# EAGLE design at88g.v1 (EAGLE 4.11)
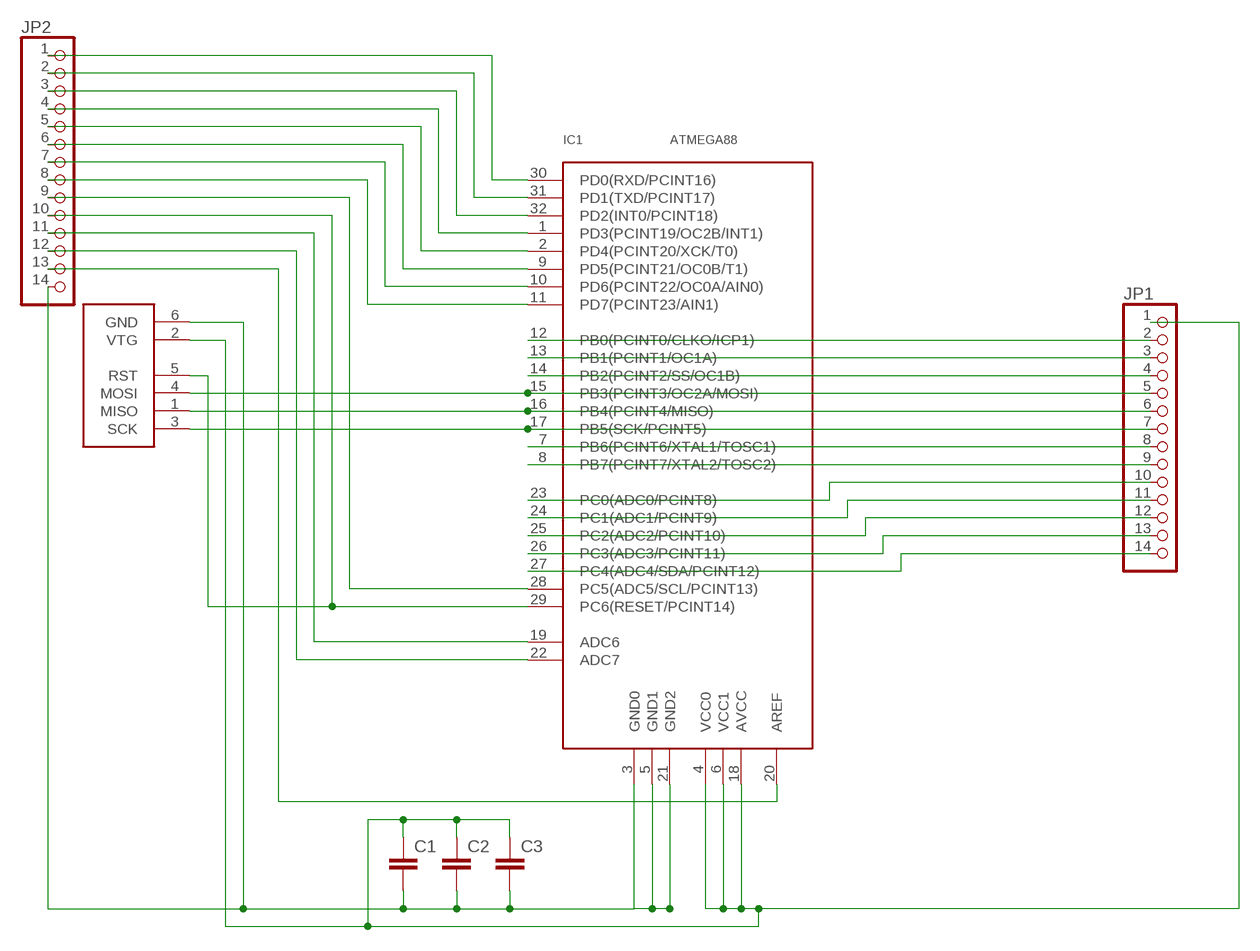
[diagram p0: schematic, sheet 1]

## Parts
C1  C-EUC0603  [C0603]
C2  C-EUC0603  [C0603]
C3  C-EUC0603  [C0603]
IC1  ATMEGA88  [TQFP32]
JP1  PINHD-1X14  [1X14]
JP2  PINHD-1X14  [1X14]
X1  AVRISP6PIN  [6PIN]

## Nets
GND0: C1.2 C2.2 C3.2 IC1.3(GND0) IC1.5(GND1) IC1.21(GND2) JP2.14 X1.6(GND)
N$1: IC1.29(PC6(RESET/PCINT14)) JP2.10 X1.5(RST)
N$2: IC1.15(PB3(PCINT3/OC2A/MOSI)) JP1.5 X1.4(MOSI)
N$3: IC1.16(PB4(PCINT4/MISO)) JP1.6 X1.1(MISO)
N$4: IC1.17(PB5(SCK/PCINT5)) JP1.7 X1.3(SCK)
N$5: IC1.30(PD0(RXD/PCINT16)) JP2.1
N$6: IC1.31(PD1(TXD/PCINT17)) JP2.2
N$7: IC1.32(PD2(INT0/PCINT18)) JP2.3
N$8: IC1.1(PD3(PCINT19/OC2B/INT1)) JP2.4
N$9: IC1.2(PD4(PCINT20/XCK/T0)) JP2.5
N$10: IC1.9(PD5(PCINT21/OC0B/T1)) JP2.6
N$11: IC1.10(PD6(PCINT22/OC0A/AIN0)) JP2.7
N$12: IC1.11(PD7(PCINT23/AIN1)) JP2.8
N$13: IC1.12(PB0(PCINT0/CLKO/ICP1)) JP1.2
N$14: IC1.13(PB1(PCINT1/OC1A)) JP1.3
N$15: IC1.14(PB2(PCINT2/SS/OC1B)) JP1.4
N$16: IC1.7(PB6(PCINT6/XTAL1/TOSC1)) JP1.8
N$17: IC1.8(PB7(PCINT7/XTAL2/TOSC2)) JP1.9
N$18: IC1.23(PC0(ADC0/PCINT8)) JP1.10
N$19: IC1.24(PC1(ADC1/PCINT9)) JP1.11
N$20: IC1.25(PC2(ADC2/PCINT10)) JP1.12
N$21: IC1.26(PC3(ADC3/PCINT11)) JP1.13
N$22: IC1.27(PC4(ADC4/SDA/PCINT12)) JP1.14
N$23: IC1.28(PC5(ADC5/SCL/PCINT13)) JP2.9
N$24: IC1.19(ADC6) JP2.11
N$25: IC1.22(ADC7) JP2.12
N$26: IC1.20(AREF) JP2.13
VCC0: C1.1 C2.1 C3.1 IC1.4(VCC0) IC1.6(VCC1) IC1.18(AVCC) JP1.1 X1.2(VTG)

## Library data of the parts
C1-C3 = rcl:C-EU: CAPACITOR, European symbol
IC1 = atmega88:ATMEGA88
JP1 JP2 = pinhead-mm:PINHD-1X14
X1 = avrisp:AVRISP6PIN

## Board
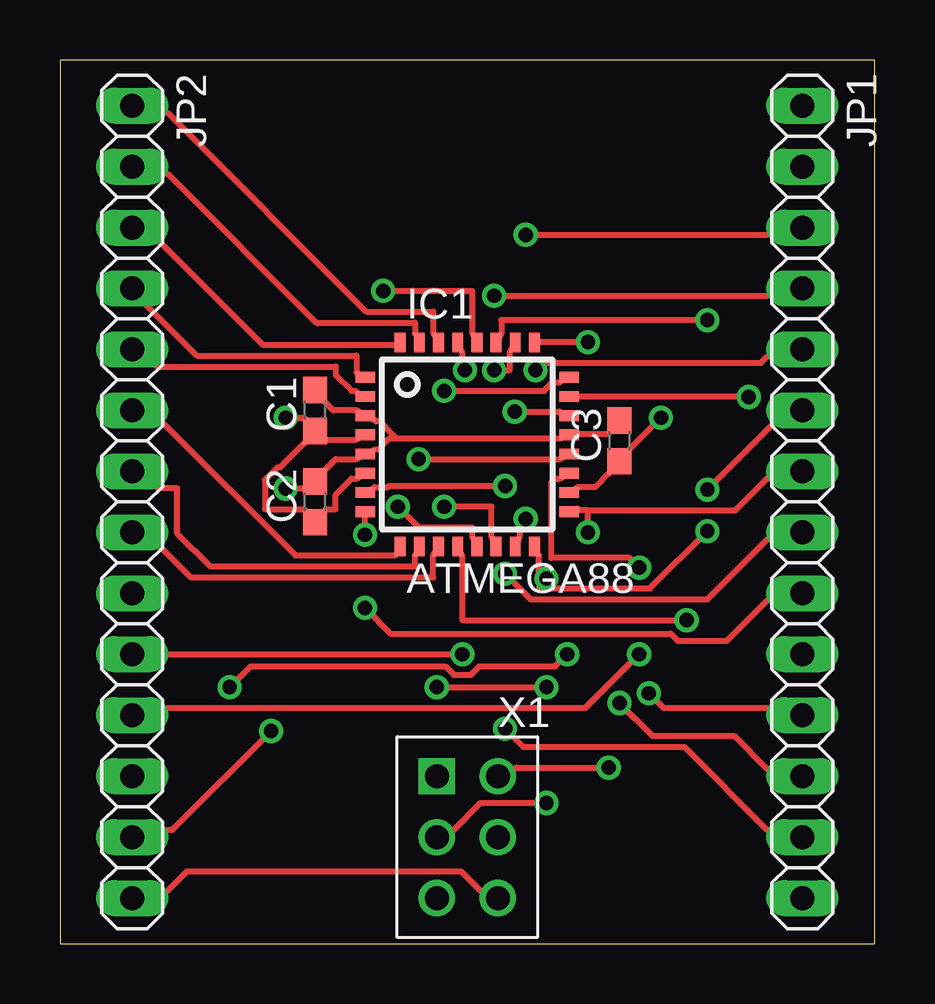
[diagram p1: board, top side]
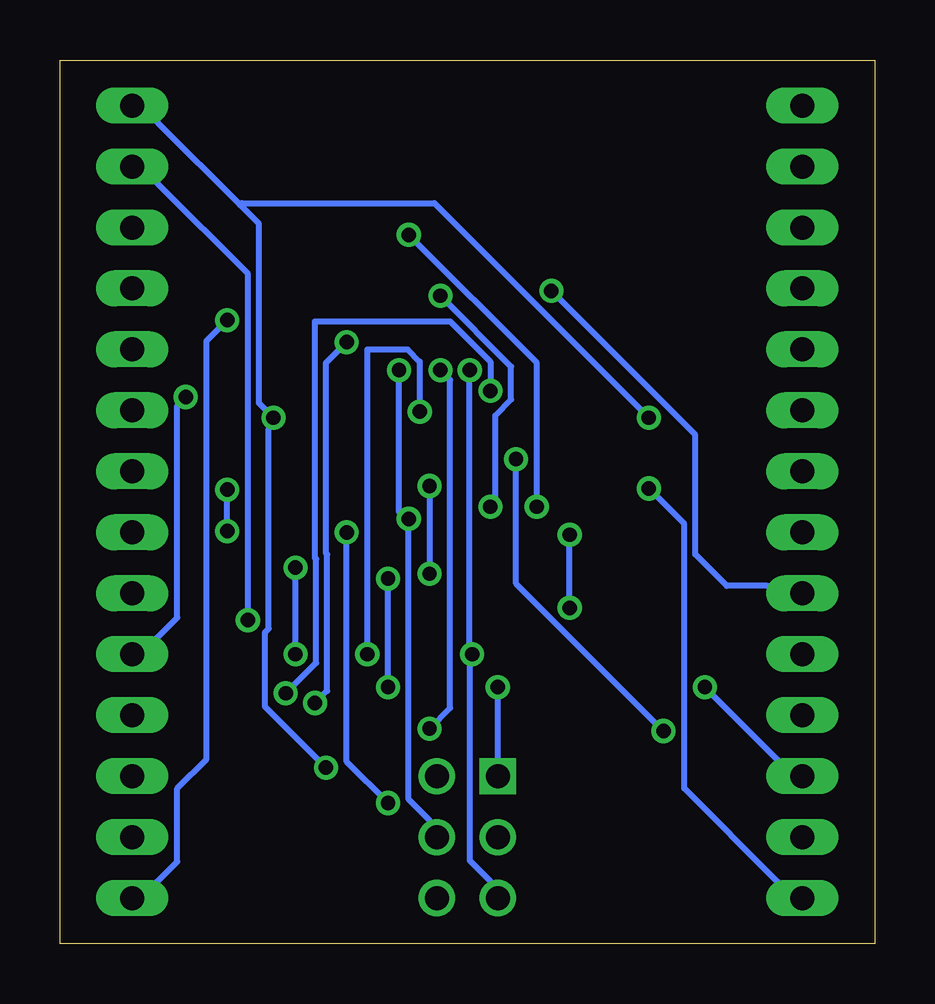
[diagram p2: board, bottom side, seen from below]

Size 33.96 x 36.82 mm. Coordinates in mm from the lower left corner, seen from the top.
Outline: 0,0 33.96,0 33.96,36.82 0,36.82 0,0
Copper layers (1*16): Top 0.035mm / dielectric 1.5mm / Bottom 0.035mm
Design rules "default": minimum track width 10mil, minimum drill 0.6mm, track to track 8mil, track to pad 8mil, pad to pad 8mil, via to via 8mil, smd to smd 8mil, copper to edge 40mil, drill to drill 8mil, minimum pad ring 10mil, minimum via ring 8mil, stop-mask expansion 4mil, vias tented up to drill 0mil, thermal gap 10mil

### Footprints (pad centres in the part's own frame; a part is rotated, then mirrored left to right if it is on the bottom)
C0603 = smd 1.1 x 1: 1 -0.85,0; 2 0.85,0
TQFP32 = smd 0.8 x 0.45: 1 -4.25,2.65; 2 -4.25,1.85; 3 -4.25,1.05; 4 -4.25,0.25; 5 -4.25,-0.55; 6 -4.25,-1.35; 7 -4.25,-2.15; 8 -4.25,-2.95; 17 4.25,-2.95; 18 4.25,-2.15; 19 4.25,-1.35; 20 4.25,-0.55; 21 4.25,0.25; 22 4.25,1.05; 23 4.25,1.85; 24 4.25,2.65 | smd 0.45 x 0.8: 9 -2.8,-4.4; 10 -2,-4.4; 11 -1.2,-4.4; 12 -0.4,-4.4; 13 0.4,-4.4; 14 1.2,-4.4; 15 2,-4.4; 16 2.8,-4.4; 25 2.8,4.1; 26 2,4.1; 27 1.2,4.1; 28 0.4,4.1; 29 -0.4,4.1; 30 -1.2,4.1; 31 -2,4.1; 32 -2.8,4.1
1X14 = drill 1 long: 1 -16.51,0; 2 -13.97,0; 3 -11.43,0; 4 -8.89,0; 5 -6.35,0; 6 -3.81,0; 7 -1.27,0; 8 1.27,0; 9 3.81,0; 10 6.35,0; 11 8.89,0; 12 11.43,0; 13 13.97,0; 14 16.51,0
6PIN = drill 1 square: 1 -1.27,2.54 | drill 1 round: 2 1.27,2.54; 3 -1.27,0; 4 1.27,0; 5 -1.27,-2.54; 6 1.27,-2.54

### Placement (x,y rotation side)
C1  10.63,22.22 90 top
C2  10.63,18.41 90 top
C3  23.33,20.95 90 top
IC1  16.98,20.95 0 top
JP1  30.95,18.41 270 top
JP2  3.01,18.41 270 top
X1  16.98,4.44 0 top

### Tracks (layer width: path | path; a pad name or v marks a point on that pad's centre or on a via)
GND0  (via drill 0.6)
  Top 0.254: C1.2 11.09,22.53 11.39,22.22 12.36,22.22 IC1.3 13.12,21.81 13.17,21.76 13.32,21.76 13.93,21.15 13.93,21.05 | C3.2 22.87,21.26 21.6,21.26 IC1.21 20.84,21.05 13.93,21.05 | 13.93,21.05 13.73,21.05 13.27,20.59 13.12,20.59 IC1.5 12.36,20.19 11.49,20.19 11.09,19.78 C2.2 10.17,18.97 v9.41,18.97 | JP2.14 4.48,2.21 5.3,3.02 16.73,3.02 17.54,2.21 X1.6
  Bottom 0.254: v9.41,18.97 7.94,17.5 7.94,6.47 4.08,2.61 JP2.14
N$1  (via drill 0.6)
  Top 0.254: v16.88,23.9 16.78,23.9 16.78,24.66 IC1.29 | JP2.10 v16.78,12.06
  Bottom 0.254: 16.88,12.06 16.88,3.48 16.02,2.61 X1.5 | 16.88,12.06 v16.88,23.9 | v16.78,12.06 16.88,12.06
N$2  (via drill 0.6)
  Top 0.254: v19.42,17.7 19.16,17.7 19.16,16.94 IC1.15 | v19.82,23.9 20.13,24.2 29.22,24.2 29.48,24.45 JP1.5
  Bottom 0.254: X1.4 18.55,5.15 19.42,6.02 v19.42,17.7 19.82,18 v19.82,23.9
N$3  (via drill 0.6)
  Top 0.254: 19.98,15.21 19.98,14.8 24.6,14.8 v26.99,17.19 | 19.98,15.21 19.98,16.18 IC1.16 | v26.99,18.92 29.73,21.66 JP1.6 | v15.71,10.69 v20.28,10.69 | v20.28,15.21 19.98,15.21
  Bottom 0.254: v26.99,17.19 v26.99,18.92 | v20.28,10.69 v20.28,15.21 | X1.1 v15.71,10.69
N$4  (via drill 0.6)
  Top 0.254: 22.01,18.05 28.16,18.05 29.48,19.38 JP1.7 | 22.01,18.05 21.6,18.05 IC1.17 | v20.28,5.86 17.54,5.86 16.42,4.75 X1.3 | v22.01,17.14 22.01,18.05
  Bottom 0.254: v20.28,5.86 22.01,7.59 v22.01,17.14
N$5
  Top 0.254: IC1.30 15.56,25.42 15.56,26.34 12.76,26.34 4.48,34.62 JP2.1
N$6
  Top 0.254: IC1.31 14.8,25.42 14.8,25.88 10.68,25.88 4.48,32.08 JP2.2
N$7
  Top 0.254: IC1.32 13.98,24.96 8.45,24.96 4.18,29.23 JP2.3
N$8
  Top 0.254: IC1.1 12.36,23.8 12.36,24.51 5.7,24.51 3.62,26.59 JP2.4
N$9
  Top 0.254: IC1.2 12.36,22.98 12.31,23.03 12.15,23.03 11.49,23.69 11.49,24.05 4.08,24.05 JP2.5
N$10
  Top 0.254: IC1.9 13.98,16.18 9.82,16.18 4.28,21.71 JP2.6
N$11
  Top 0.254: IC1.10 14.8,16.18 14.8,15.72 6.26,15.72 4.89,17.09 4.89,18.97 4.08,18.97 JP2.7
N$12
  Top 0.254: IC1.11 15.56,16.18 15.56,15.26 5.45,15.26 4.18,16.53 JP2.8
N$13  (via drill 0.6)
  Top 0.254: v26.12,13.48 16.78,13.48 16.78,16.18 IC1.12
  Bottom 0.254: v26.12,13.48 26.12,27.91 29.88,31.67 JP1.2
N$14  (via drill 0.6)
  Top 0.254: v14.08,18.21 14.95,17.34 17.18,17.34 17.18,16.94 IC1.13 | v19.42,29.53 29.48,29.53 JP1.3
  Bottom 0.254: v14.08,18.21 14.08,24.2 v19.42,29.53
N$15  (via drill 0.6)
  Top 0.254: v16.02,18.21 18,18.21 18,16.94 IC1.14 | v18.1,27 29.48,27 JP1.4
  Bottom 0.254: v16.02,18.21 15.81,18.41 15.81,22.02 15.15,22.68 15.15,24.05 v18.1,27
N$16  (via drill 0.6)
  Top 0.254: v18.55,19.07 13.73,19.07 13.68,19.02 13.12,19.02 IC1.7 | v18.55,15.41 19.62,14.35 26.99,14.35 29.48,16.84 JP1.8
  Bottom 0.254: v18.55,19.07 v18.55,15.41
N$17  (via drill 0.6)
  Top 0.254: v12.71,17.04 12.71,17.8 IC1.8 | v12.71,13.99 13.78,12.92 25.46,12.92 25.77,12.62 27.8,12.62 29.48,14.3 JP1.9
  Bottom 0.254: v12.71,13.99 v12.71,17.04
N$18  (via drill 0.6)
  Top 0.254: v28.71,22.78 21.6,22.78 IC1.23
  Bottom 0.254: v28.71,22.78 29.07,22.42 29.07,13.58 29.88,12.77 JP1.10
N$19  (via drill 0.6)
  Top 0.254: v16.02,23.03 20.18,23.03 20.54,23.39 20.84,23.39 IC1.24 | v24.55,10.43 25.16,9.83 29.48,9.83 JP1.11
  Bottom 0.254: v16.02,23.03 16.02,24.25 17.69,25.93 23.33,25.93 23.33,16.07 23.28,16.02 23.28,11.7 v24.55,10.43
N$20  (via drill 0.6)
  Top 0.254: v22.01,25.06 19.98,25.06 IC1.25 | v23.33,10.03 24.7,8.66 28.11,8.66 29.48,7.29 JP1.12
  Bottom 0.254: v22.01,25.06 22.87,24.2 22.87,16.28 22.82,16.23 22.82,10.54 v23.33,10.03
N$21  (via drill 0.6)
  Top 0.254: v18.1,23.9 18.76,23.9 18.76,24.66 IC1.26 | v18.55,8.96 19.32,8.2 26.02,8.2 29.48,4.75 JP1.13
  Bottom 0.254: v18.1,23.9 17.69,23.49 17.69,9.83 v18.55,8.96
N$22  (via drill 0.6)
  Top 0.254: v26.99,25.98 18.4,25.98 18.4,25.42 IC1.27
  Bottom 0.254: v26.99,25.98 27.85,25.12 27.85,7.69 29.07,6.47 29.07,3.42 29.88,2.61 JP1.14
N$23  (via drill 0.6)
  Top 0.254: v13.48,27.2 17.18,27.2 17.18,25.42 IC1.28
  Bottom 0.254: v13.48,27.2 7.48,21.2 7.48,16.23 6.16,14.91 4.48,14.91 JP2.9
N$24  (via drill 0.6)
  Top 0.254: v24.14,15.67 23.74,16.07 20.48,16.07 20.48,19.22 20.64,19.38 20.84,19.38 IC1.19 | v24.14,12.06 21.91,9.83 4.48,9.83 JP2.11
  Bottom 0.254: v24.14,12.06 v24.14,15.67
N$25  (via drill 0.6)
  Top 0.254: v18.96,22.17 20.84,22.17 IC1.22 | v21.15,12.06 20.64,11.55 17.49,11.55 17.13,11.2 16.42,11.2 16.07,11.55 7.94,11.55 v7.07,10.69
  Bottom 0.254: v18.96,22.17 18.96,24.25 19.47,24.76 21.15,24.76 v21.15,12.06 | v7.07,10.69 4.08,7.69 JP2.12
N$26  (via drill 0.6)
  Top 0.254: v14.95,20.19 20.84,20.19 IC1.20 | v8.8,8.86 4.69,4.75 4.48,4.75 JP2.13
  Bottom 0.254: v14.95,20.19 14.95,15.01 v8.8,8.86
VCC0  (via drill 0.6)
  Top 0.254: IC1.4 12.36,21 11.09,21 C1.1 | IC1.6 12.36,19.38 12.15,19.38 11.49,18.72 11.49,18.11 11.09,18.11 C2.1 10.17,18.11 8.55,18.11 8.55,19.32 9.06,19.83 9.16,19.83 10.17,20.85 C1.1 | IC1.18 21.6,19.02 22.31,19.02 22.87,19.58 C3.1 23.79,20.65 v25.06,21.92 | v22.87,7.34 19.01,7.34 18.96,7.29 X1.2 | v9.41,21.92 10.17,21.92 C1.1
  Bottom 0.254: 26.45,30.78 29.88,34.21 JP1.1 | 26.45,30.78 25.67,29.99 25.67,22.53 v25.06,21.92 25.26,21.46 25.26,13.13 25.41,12.97 25.41,9.88 v22.87,7.34 | v9.41,21.92 18.35,30.86 26.38,30.86 26.45,30.78